# Altium schematic sheet 9_VO Interface_1.schdoc
size 431 x 309 mm; Symbol: Sheet-Symbol_A4; Device: Sheet-Symbol_A4; Company: 嘉立创EDA; Version: V1.0; Page Size: A4; @Project Name: RK3568核心板; @Page Count: 10; @Update Date: 2024-10-10; @Create Date: 2024-10-10; @Schematic Name: Schematic1; @Page No: 8; @Page Name: VO Interface_1; @Board Name: Board1; @Create Time: 10:47:09; @Update Time: 11:14:26; Width: 1655; Height: 1170; Region Start: 1; X Region Count: 6; Y Region Count: 4; Blade Width: 10; Title Block Position: 3
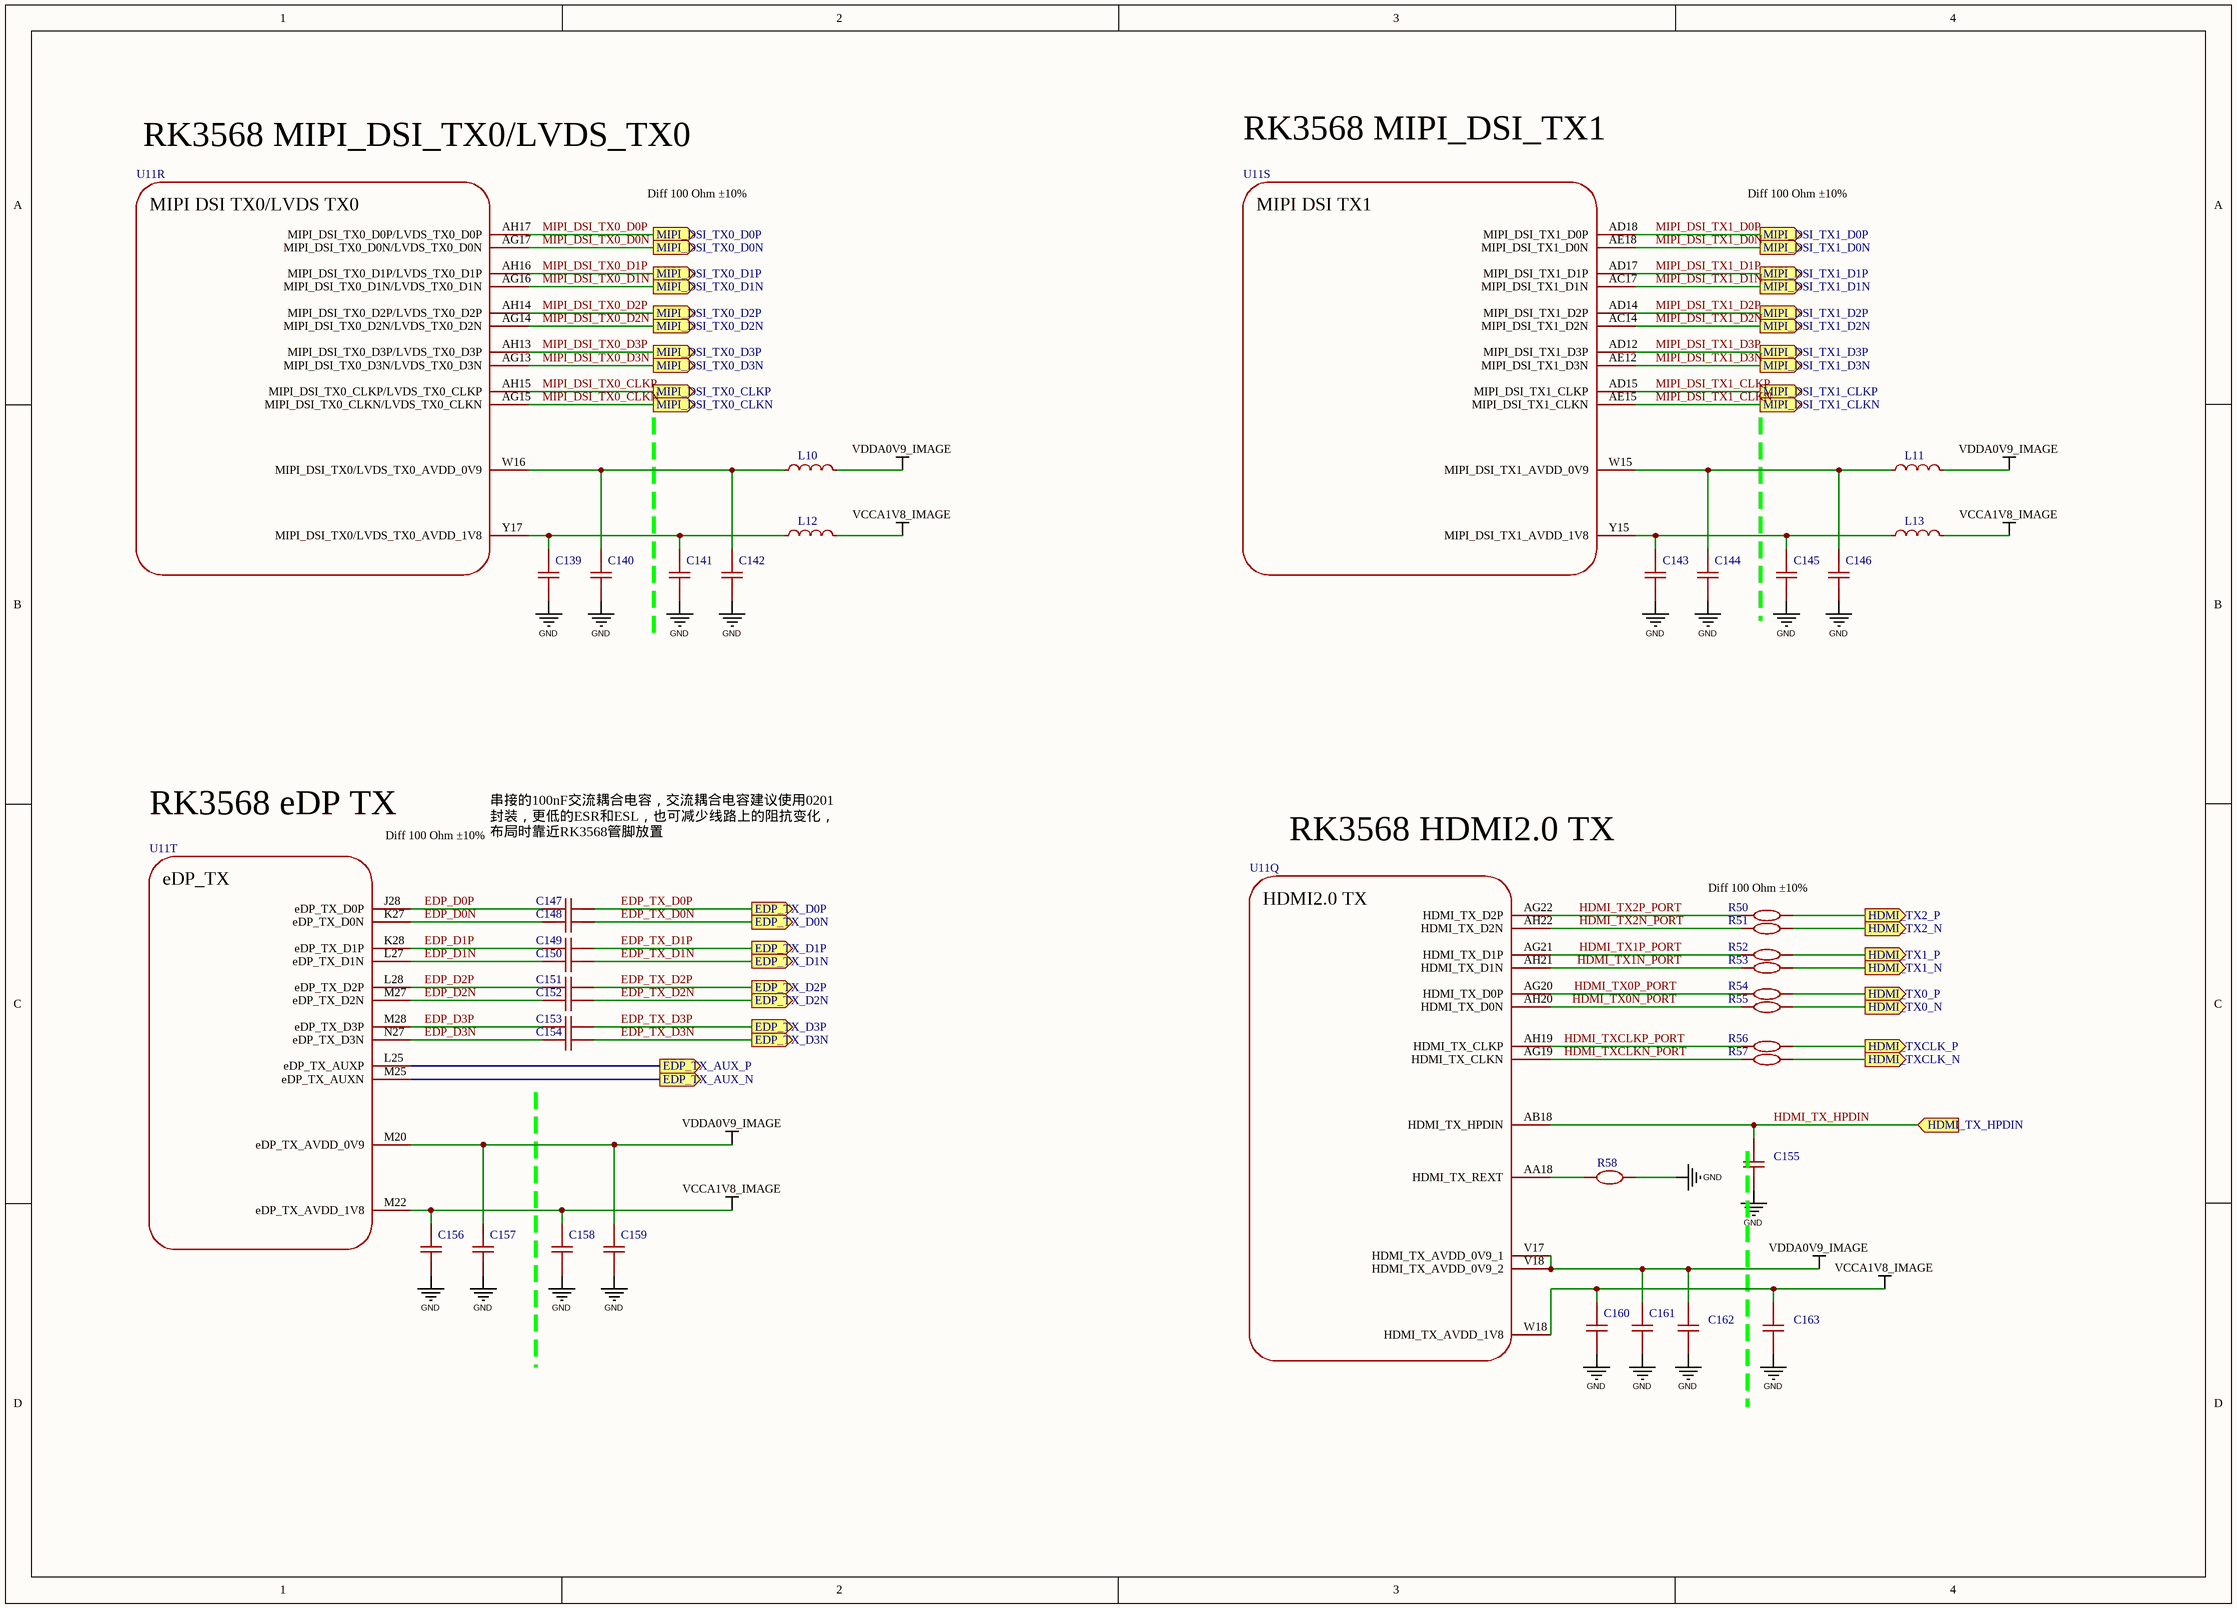
[diagram p0: 9_VO Interface_1.schdoc]

## Parts
C139  100nF  [C0201]  (value not drawn)
C140  100nF  [C0201]  (value not drawn)
C141  1uF  [C0402]  (value not drawn)
C142  1uF  [C0402]  (value not drawn)
C143  100nF  [C0201]  (value not drawn)
C144  100nF  [C0201]  (value not drawn)
C145  1uF  [C0402]  (value not drawn)
C146  1uF  [C0402]  (value not drawn)
C147  100nF  [C0201]  (value not drawn)
C148  100nF  [C0201]  (value not drawn)
C149  100nF  [C0201]  (value not drawn)
C150  100nF  [C0201]  (value not drawn)
C151  100nF  [C0201]  (value not drawn)
C152  100nF  [C0201]  (value not drawn)
C153  100nF  [C0201]  (value not drawn)
C154  100nF  [C0201]  (value not drawn)
C155  100nF  [C0402]  (value not drawn)
C156  100nF  [C0201]  (value not drawn)
C157  100nF  [C0201]  (value not drawn)
C158  1uF  [C0402]  (value not drawn)
C159  1uF  [C0402]  (value not drawn)
C160  100nF  [C0201]  (value not drawn)
C161  100nF  [C0201]  (value not drawn)
C162  4.7uF  [C0201]  (value not drawn)
C163  4.7uF  [C0201]  (value not drawn)
L10  120R 100MHz  [L0603]  (value not drawn)
L11  120R 100MHz  [L0603]  (value not drawn)
L12  120R 100MHz  [L0603]  (value not drawn)
L13  120R 100MHz  [L0603]  (value not drawn)
R50  2.2Ω  [R0201]  (value not drawn)
R51  2.2Ω  [R0201]  (value not drawn)
R52  2.2Ω  [R0201]  (value not drawn)
R53  2.2Ω  [R0201]  (value not drawn)
R54  2.2Ω  [R0201]  (value not drawn)
R55  2.2Ω  [R0201]  (value not drawn)
R56  2.2Ω  [R0201]  (value not drawn)
R57  2.2Ω  [R0201]  (value not drawn)
R58  1.62kΩ  [R0201]  (value not drawn)
U11  SOC_RK3568  [RK3568]  (value not drawn)  (parts Q,R,S,T of 23)

## Ports
EDP_TX_AUX_N (out), EDP_TX_AUX_P (out), EDP_TX_D0N (out), EDP_TX_D0P (out), EDP_TX_D1N (out), EDP_TX_D1P (out), EDP_TX_D2N (out), EDP_TX_D2P (out), EDP_TX_D3N (out), EDP_TX_D3P (out), HDMI_TX0_N (out), HDMI_TX0_P (out), HDMI_TX1_N (out), HDMI_TX1_P (out), HDMI_TX2_N (out), HDMI_TX2_P (out), HDMI_TX_HPDIN (in), HDMI_TXCLK_N (out), HDMI_TXCLK_P (out), MIPI_DSI_TX0_CLKN (out), MIPI_DSI_TX0_CLKP (out), MIPI_DSI_TX0_D0N (out), MIPI_DSI_TX0_D0P (out), MIPI_DSI_TX0_D1N (out), MIPI_DSI_TX0_D1P (out), MIPI_DSI_TX0_D2N (out), MIPI_DSI_TX0_D2P (out), MIPI_DSI_TX0_D3N (out), MIPI_DSI_TX0_D3P (out), MIPI_DSI_TX1_CLKN (out), MIPI_DSI_TX1_CLKP (out), MIPI_DSI_TX1_D0N (out), MIPI_DSI_TX1_D0P (out), MIPI_DSI_TX1_D1N (out), MIPI_DSI_TX1_D1P (out), MIPI_DSI_TX1_D2N (out), MIPI_DSI_TX1_D2P (out), MIPI_DSI_TX1_D3N (out), MIPI_DSI_TX1_D3P (out)

## Nets
GND: C139.1 C140.1 C141.1 C142.1 C143.1 C144.1 C145.1 C146.1 C155.1 C156.1 C157.1 C158.1 C159.1 C160.1 C161.1 C162.2 C163.2 R58.2
VCCA1V8_IMAGE: C156.2 C158.2 C160.2 C163.1 L12.2 L13.2 U11.M22(eDP_TX_AVDD_1V8) U11.W18(HDMI_TX_AVDD_1V8)
VDDA0V9_IMAGE: C157.2 C159.2 C161.2 C162.1 L10.2 L11.2 U11.M20(eDP_TX_AVDD_0V9) U11.V17(HDMI_TX_AVDD_0V9_1) U11.V18(HDMI_TX_AVDD_0V9_2)
EDP_D0N: C148.1 U11.K27(eDP_TX_D0N)
EDP_D0P: C147.2 U11.J28(eDP_TX_D0P)
EDP_D1N: C150.1 U11.L27(eDP_TX_D1N)
EDP_D1P: C149.2 U11.K28(eDP_TX_D1P)
EDP_D2N: C152.1 U11.M27(eDP_TX_D2N)
EDP_D2P: C151.2 U11.L28(eDP_TX_D2P)
EDP_D3N: C154.1 U11.N27(eDP_TX_D3N)
EDP_D3P: C153.2 U11.M28(eDP_TX_D3P)
EDP_TX_AUX_N: U11.M25(eDP_TX_AUXN) ; port EDP_TX_AUX_N
EDP_TX_AUX_P: U11.L25(eDP_TX_AUXP) ; port EDP_TX_AUX_P
EDP_TX_D0N: C148.2 ; port EDP_TX_D0N
EDP_TX_D0P: C147.1 ; port EDP_TX_D0P
EDP_TX_D1N: C150.2 ; port EDP_TX_D1N
EDP_TX_D1P: C149.1 ; port EDP_TX_D1P
EDP_TX_D2N: C152.2 ; port EDP_TX_D2N
EDP_TX_D2P: C151.1 ; port EDP_TX_D2P
EDP_TX_D3N: C154.2 ; port EDP_TX_D3N
EDP_TX_D3P: C153.1 ; port EDP_TX_D3P
HDMI_TX0_N: R55.2 ; port HDMI_TX0_N
HDMI_TX0_P: R54.2 ; port HDMI_TX0_P
HDMI_TX0N_PORT: R55.1 U11.AH20(HDMI_TX_D0N)
HDMI_TX0P_PORT: R54.1 U11.AG20(HDMI_TX_D0P)
HDMI_TX1_N: R53.2 ; port HDMI_TX1_N
HDMI_TX1_P: R52.2 ; port HDMI_TX1_P
HDMI_TX1N_PORT: R53.1 U11.AH21(HDMI_TX_D1N)
HDMI_TX1P_PORT: R52.1 U11.AG21(HDMI_TX_D1P)
HDMI_TX2_N: R51.2 ; port HDMI_TX2_N
HDMI_TX2_P: R50.2 ; port HDMI_TX2_P
HDMI_TX2N_PORT: R51.1 U11.AH22(HDMI_TX_D2N)
HDMI_TX2P_PORT: R50.1 U11.AG22(HDMI_TX_D2P)
HDMI_TX_HPDIN: C155.2 U11.AB18(HDMI_TX_HPDIN) ; port HDMI_TX_HPDIN
HDMI_TXCLK_N: R57.2 ; port HDMI_TXCLK_N
HDMI_TXCLK_P: R56.2 ; port HDMI_TXCLK_P
HDMI_TXCLKN_PORT: R57.1 U11.AG19(HDMI_TX_CLKN)
HDMI_TXCLKP_PORT: R56.1 U11.AH19(HDMI_TX_CLKP)
MIPI_DSI_TX0_CLKN: U11.AG15(MIPI_DSI_TX0_CLKN/LVDS_TX0_CLKN) ; port MIPI_DSI_TX0_CLKN
MIPI_DSI_TX0_CLKP: U11.AH15(MIPI_DSI_TX0_CLKP/LVDS_TX0_CLKP) ; port MIPI_DSI_TX0_CLKP
MIPI_DSI_TX0_D0N: U11.AG17(MIPI_DSI_TX0_D0N/LVDS_TX0_D0N) ; port MIPI_DSI_TX0_D0N
MIPI_DSI_TX0_D0P: U11.AH17(MIPI_DSI_TX0_D0P/LVDS_TX0_D0P) ; port MIPI_DSI_TX0_D0P
MIPI_DSI_TX0_D1N: U11.AG16(MIPI_DSI_TX0_D1N/LVDS_TX0_D1N) ; port MIPI_DSI_TX0_D1N
MIPI_DSI_TX0_D1P: U11.AH16(MIPI_DSI_TX0_D1P/LVDS_TX0_D1P) ; port MIPI_DSI_TX0_D1P
MIPI_DSI_TX0_D2N: U11.AG14(MIPI_DSI_TX0_D2N/LVDS_TX0_D2N) ; port MIPI_DSI_TX0_D2N
MIPI_DSI_TX0_D2P: U11.AH14(MIPI_DSI_TX0_D2P/LVDS_TX0_D2P) ; port MIPI_DSI_TX0_D2P
MIPI_DSI_TX0_D3N: U11.AG13(MIPI_DSI_TX0_D3N/LVDS_TX0_D3N) ; port MIPI_DSI_TX0_D3N
MIPI_DSI_TX0_D3P: U11.AH13(MIPI_DSI_TX0_D3P/LVDS_TX0_D3P) ; port MIPI_DSI_TX0_D3P
MIPI_DSI_TX1_CLKN: U11.AE15(MIPI_DSI_TX1_CLKN) ; port MIPI_DSI_TX1_CLKN
MIPI_DSI_TX1_CLKP: U11.AD15(MIPI_DSI_TX1_CLKP) ; port MIPI_DSI_TX1_CLKP
MIPI_DSI_TX1_D0N: U11.AE18(MIPI_DSI_TX1_D0N) ; port MIPI_DSI_TX1_D0N
MIPI_DSI_TX1_D0P: U11.AD18(MIPI_DSI_TX1_D0P) ; port MIPI_DSI_TX1_D0P
MIPI_DSI_TX1_D1N: U11.AC17(MIPI_DSI_TX1_D1N) ; port MIPI_DSI_TX1_D1N
MIPI_DSI_TX1_D1P: U11.AD17(MIPI_DSI_TX1_D1P) ; port MIPI_DSI_TX1_D1P
MIPI_DSI_TX1_D2N: U11.AC14(MIPI_DSI_TX1_D2N) ; port MIPI_DSI_TX1_D2N
MIPI_DSI_TX1_D2P: U11.AD14(MIPI_DSI_TX1_D2P) ; port MIPI_DSI_TX1_D2P
MIPI_DSI_TX1_D3N: U11.AE12(MIPI_DSI_TX1_D3N) ; port MIPI_DSI_TX1_D3N
MIPI_DSI_TX1_D3P: U11.AD12(MIPI_DSI_TX1_D3P) ; port MIPI_DSI_TX1_D3P
NetC139_2: C139.2 C141.2 L12.1 U11.Y17(MIPI_DSI_TX0/LVDS_TX0_AVDD_1V8)
NetC140_2: C140.2 C142.2 L10.1 U11.W16(MIPI_DSI_TX0/LVDS_TX0_AVDD_0V9)
NetC143_2: C143.2 C145.2 L13.1 U11.Y15(MIPI_DSI_TX1_AVDD_1V8)
NetC144_2: C144.2 C146.2 L11.1 U11.W15(MIPI_DSI_TX1_AVDD_0V9)
NetR58_1: R58.1 U11.AA18(HDMI_TX_REXT)

## Notes on the sheet
- RK3568 MIPI_DSI_TX0/LVDS_TX0
- RK3568 MIPI_DSI_TX1
- Diff 100 Ohm ±10%
- RK3568 eDP TX
- RK3568 HDMI2.0 TX
- 串接的100nF交流耦合电容，交流耦合电容建议使用0201封装，更低的ESR和ESL，也可减少线路上的阻抗变化，布局时靠近RK3568管脚放置
- 1
- 2
- 3
- 4
- 5
- 6
- A
- B
- C
- D
- 原理图
- Schematic1
- 创建日期
- 更新日期
- 2024-10-10
- 审阅
- 绘制
- 图页
- VO Interface_1
- 物料编码
- RK3568核心板
- 版本
- 尺寸
- 页
- 8
- 共
- 10
- V1.0
- A4
- 嘉立创EDA
- (in symbol SOC_RK3568, part Q) HDMI2.0 TX
- (in symbol SOC_RK3568, part R) MIPI DSI TX0/LVDS TX0
- (in symbol SOC_RK3568, part S) MIPI DSI TX1
- (in symbol SOC_RK3568, part T) eDP_TX

## Library data of the parts
C139 C140 C143 C144 C147-C154 C156 C157 C160 C161 = CL03A104KO3NNNC: 容值:100nF;精度:±10%;额定电压:16V;材质(温度系数):X5R;; Manufacturer: SAMSUNG(三星); Add into BOM: yes; Tolerance: ±10%; Voltage Rated: 16V; Temperature Coefficient: X5R; Symbol: CL03A104KO3NNNC; Device: CL03A104KO3NNNC; LCSC Part Name: 100nF ±10% 16V; Supplier Part: C307380; Manufacturer Part: CL03A104KO3NNNC; Supplier Footprint: 0201; JLCPCB Part Class: 扩展库; Datasheet: https://atta.szlcsc.com/upload/public/pdf/source/20160218/1457707763339.pdf; Supplier: LCSC; Convert to PCB: yes; Value: 100nF
C141 C142 C145 C146 C158 C159 = CL05A105KA5NQNC: 容值:1uF;精度:±10%;额定电压:25V;材质(温度系数):X5R;; Manufacturer: SAMSUNG(三星); Add into BOM: yes; Tolerance: ±10%; Voltage Rated: 25V; Temperature Coefficient: X5R; Symbol: CL05A105KA5NQNC; Device: CL05A105KA5NQNC; LCSC Part Name: 1uF ±10% 25V; Supplier Part: C52923; Manufacturer Part: CL05A105KA5NQNC; Supplier Footprint: 0402; JLCPCB Part Class: 基础库; Datasheet: https://atta.szlcsc.com/upload/public/pdf/source/20160218/1457707763339.pdf; Supplier: LCSC; Convert to PCB: yes; Value: 1uF
C155 = CL05B104KB54PNC: 容值:100nF;精度:±10%;额定电压:50V;材质(温度系数):X7R;; Manufacturer: SAMSUNG(三星); Add into BOM: yes; Tolerance: ±10%; Voltage Rated: 50V; Temperature Coefficient: X7R; Symbol: CL05B104KB54PNC; Device: CL05B104KB54PNC; LCSC Part Name: 100nF ±10% 50V; Supplier Part: C307331; Manufacturer Part: CL05B104KB54PNC; Supplier Footprint: 0402; JLCPCB Part Class: 基础库; Datasheet: https://atta.szlcsc.com/upload/public/pdf/source/20160218/1457707763339.pdf; Supplier: LCSC; Convert to PCB: yes; Value: 100nF
C162 C163 = GRM035R60J475ME15D: 容值:4.7uF;精度:±20%;额定电压:6.3V;材质(温度系数):X5R;; Manufacturer: muRata(村田); Add into BOM: yes; Tolerance: ±20%; Voltage Rated: 6.3V; Temperature Coefficient: X5R; Symbol: GRM035R60J475ME15D; Device: GRM035R60J475ME15D; LCSC Part Name: 4.7uF ±20% 6.3V; Supplier Part: C335103; Manufacturer Part: GRM035R60J475ME15D; Supplier Footprint: 0201; JLCPCB Part Class: 扩展库; Datasheet: https://atta.szlcsc.com/upload/public/pdf/source/20200305/C490387_23319AE8C154DEB24C505E6C82A8106A.pdf; Supplier: LCSC; Convert to PCB: yes; Value: 4.7uF
L10-L13 = BLM18PG121SN1D: 标称阻抗@测试频率:120Ω@100MHz;误差:±25%;直流电阻(RDC):50mΩ;; Manufacturer: muRata(村田); Symbol: BLM18PG121SN1D_C14709; Add into BOM: yes; Tolerance: ±25%; DC Resistance: 50mΩ; Current Rating: 2A; Circuits: 1; Device: BLM18PG121SN1D; LCSC Part Name: 单路 0603磁珠 阻抗120Ω@100MHz; Supplier Part: C14709; Manufacturer Part: 120R 100MHz; Supplier Footprint: 0603; JLCPCB Part Class: 扩展库; Datasheet: https://atta.szlcsc.com/upload/public/pdf/source/20130704/1457706621422.pdf; Supplier: LCSC; Convert to PCB: yes; Impedance @ Frequency: 120Ω@100MHz
R50-R57 = 0201WMJ022JTEE: 电阻类型:厚膜电阻;阻值:2.2Ω;精度:±5%;功率:50mW;最大工作电压:25V;温度系数:±400ppm/℃;; Manufacturer: UNI-ROYAL(厚声); Add into BOM: yes; Tolerance: ±5%; Power(Watts): 50mW; Overload Voltage (Max): 25V; Symbol: 0201WMJ022JTEE; Device: 0201WMJ022JTEE; LCSC Part Name: 2.2Ω ±5% 50mW 厚膜电阻; Supplier Part: C270323; Manufacturer Part: 0201WMJ022JTEE; Supplier Footprint: 0201; JLCPCB Part Class: 扩展库; Datasheet: https://atta.szlcsc.com/upload/public/pdf/source/20200306/C422600_1E6D84923E4A46A82E41ADD87F860B5C.pdf; Supplier: LCSC; Convert to PCB: yes; Type: 厚膜电阻; Value: 2.2Ω; Temperature Coefficient: ±400ppm/℃; Operating Temperature Range: -55℃~+155℃
R58 = 0201WMF1621TEE: 电阻类型:厚膜电阻;阻值:1.62kΩ;精度:±1%;功率:50mW;最大工作电压:25V;温度系数:±200ppm/℃;; Manufacturer: UNI-ROYAL(厚声); Add into BOM: yes; Tolerance: ±1%; Power(Watts): 50mW; Overload Voltage (Max): 25V; Symbol: 0201WMF1621TEE; Device: 0201WMF1621TEE; Supplier: LCSC; Supplier Part: C423711; Manufacturer Part: 0201WMF1621TEE; Value: 1.62kΩ; JLCPCB Part Class: 扩展库; LCSC Part Name: 1.62kΩ ±1% 50mW 厚膜电阻; Supplier Footprint: 0201; Datasheet: https://atta.szlcsc.com/upload/public/pdf/source/20200306/C422600_1E6D84923E4A46A82E41ADD87F860B5C.pdf; Convert to PCB: yes; Type: 厚膜电阻; Temperature Coefficient: ±200ppm/℃; Operating Temperature Range: -55℃~+155℃
U11 = SOC_RK3568: Part Reference: U1000; Manufacturer: Rockchip (瑞芯微); PCB footprint: BGA636_19R00X19R00X1R20; SWAP_INFO: (S1+S2+S3+S4+S5+S6+S7+S8+S9+S10+S11+S12+S13+S14+S15+S16+S17+S18+S19+S20+S21+S22+S23); SPLIT_INST: TRUE; Value: RK3568; Priority: A; Add into BOM: yes; Relevance: []; Symbol: SOC_RK3568; Device: SOC_RK3568; RK PN: RK3568; Part Type: SOC; Manufacturer PN: RK3568; Created by: JJJ; Origin Footprint 2: BGA636_19R00X19R00X1R20; Convert to PCB: yes